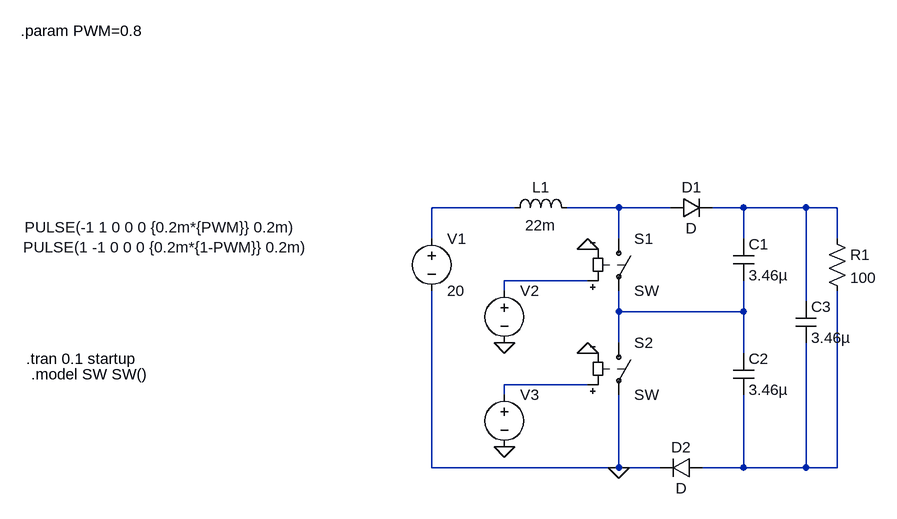
[diagram p0: schematic BoostconverterD2.asc]
BoostconverterD2.asc, the LTspice schematic file:
Version 4
SHEET 1 1428 680
WIRE -32 80 -160 80
WIRE 128 80 48 80
WIRE 208 80 128 80
WIRE 320 80 272 80
WIRE 416 80 320 80
WIRE 464 80 416 80
WIRE -160 128 -160 80
WIRE 128 128 128 80
WIRE 320 128 320 80
WIRE 464 128 464 80
WIRE 80 192 -48 192
WIRE -48 208 -48 192
WIRE 416 224 416 80
WIRE 128 240 128 208
WIRE 320 240 320 192
WIRE 320 240 128 240
WIRE 128 288 128 240
WIRE 320 304 320 240
WIRE 80 352 -48 352
WIRE -48 368 -48 352
WIRE -160 480 -160 208
WIRE 128 480 128 368
WIRE 128 480 -160 480
WIRE 192 480 128 480
WIRE 320 480 320 368
WIRE 320 480 256 480
WIRE 416 480 416 288
WIRE 416 480 320 480
WIRE 464 480 464 208
WIRE 464 480 416 480
FLAG 128 480 0
FLAG 80 304 0
FLAG 80 144 0
FLAG -48 288 0
FLAG -48 448 0
SYMBOL voltage -160 112 R0
WINDOW 123 0 0 Left 2
WINDOW 39 0 0 Left 2
SYMATTR InstName V1
SYMATTR Value 20
SYMBOL res 448 112 R0
SYMATTR InstName R1
SYMATTR Value 100
SYMBOL cap 304 128 R0
SYMATTR InstName C1
SYMATTR Value 3.46µ
SYMBOL ind -48 96 R270
WINDOW 0 32 56 VTop 2
WINDOW 3 5 56 VBottom 2
SYMATTR InstName L1
SYMATTR Value 22m
SYMBOL diode 208 96 R270
WINDOW 0 32 32 VTop 2
WINDOW 3 0 32 VBottom 2
SYMATTR InstName D1
SYMBOL sw 128 112 R0
SYMATTR InstName S1
SYMBOL sw 128 272 R0
SYMATTR InstName S2
SYMBOL cap 304 304 R0
SYMATTR InstName C2
SYMATTR Value 3.46µ
SYMBOL diode 256 464 R90
WINDOW 0 0 32 VBottom 2
WINDOW 3 32 32 VTop 2
SYMATTR InstName D2
SYMBOL cap 400 224 R0
SYMATTR InstName C3
SYMATTR Value 3.46µ
SYMBOL voltage -48 192 R0
WINDOW 3 -738 -82 Left 2
WINDOW 123 0 0 Left 2
WINDOW 39 0 0 Left 2
SYMATTR Value PULSE(-1 1 0 0 0 {0.2m*{PWM}} 0.2m)
SYMATTR InstName V2
SYMBOL voltage -48 352 R0
WINDOW 3 -740 -211 Left 2
WINDOW 123 0 0 Left 2
WINDOW 39 0 0 Left 2
SYMATTR Value PULSE(1 -1 0 0 0 {0.2m*{1-PWM}} 0.2m)
SYMATTR InstName V3
TEXT -784 312 Left 2 !.tran 0.1 startup
TEXT -776 336 Left 2 !.model SW SW()
TEXT -792 -192 Left 2 !.param PWM=0.8

The netlist it stands for:
* BoostconverterD2.asc
V1 N001 0 20
R1 N003 N007 100
C1 N003 N005 3.46µ
L1 N001 N002 22m
D1 N002 N003 D
S1 N002 N005 N004 0 SW
S2 N005 0 N006 0 SW
C2 N005 N007 3.46µ
D2 N007 0 D
C3 N003 N007 3.46µ
V2 N004 0 PULSE(-1 1 0 0 0 {0.2m*{PWM}} 0.2m)
V3 N006 0 PULSE(1 -1 0 0 0 {0.2m*{1-PWM}} 0.2m)
.model D D
.lib standard.dio
.tran 0.1 startup
.model SW SW()
.param PWM=0.8
.backanno
.end